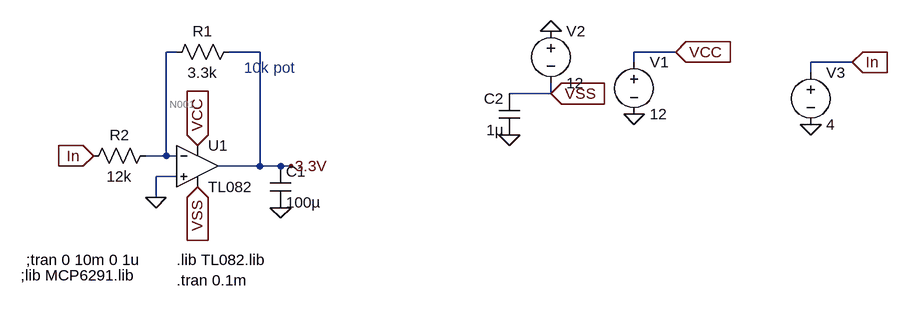
[diagram p0: schematic Draft2.asc]
Draft2.asc, the LTspice schematic file:
Version 4
SHEET 1 968 680
WIRE -176 64 -192 64
WIRE -48 64 -96 64
WIRE 592 64 528 64
WIRE 528 80 528 64
WIRE 864 80 800 80
WIRE 800 96 800 80
WIRE 400 128 400 112
WIRE 400 128 336 128
WIRE -192 224 -192 64
WIRE -192 224 -224 224
WIRE -176 224 -192 224
WIRE -48 240 -48 64
WIRE -48 240 -112 240
WIRE -16 240 -48 240
WIRE 0 240 -16 240
WIRE -176 256 -208 256
WIRE -208 288 -208 256
FLAG 0 240 3.3V
FLAG -208 288 0
FLAG -144 208 VCC
IOPIN -144 208 In
FLAG -304 224 In
IOPIN -304 224 In
FLAG -16 304 0
FLAG 528 160 0
FLAG 400 32 0
FLAG 400 128 VSS
IOPIN 400 128 In
FLAG 592 64 VCC
IOPIN 592 64 In
FLAG 336 192 0
FLAG -144 272 VSS
IOPIN -144 272 In
FLAG 800 176 0
FLAG 864 80 In
IOPIN 864 80 In
SYMBOL res -80 48 R90
WINDOW 0 0 56 VBottom 2
WINDOW 3 32 56 VTop 2
SYMATTR InstName R1
SYMATTR Value 3.3k
SYMBOL res -208 208 R90
WINDOW 0 0 56 VBottom 2
WINDOW 3 32 56 VTop 2
SYMATTR InstName R2
SYMATTR Value 12k
SYMBOL cap -32 240 R0
SYMATTR InstName C1
SYMATTR Value 100µ
SYMBOL voltage 528 64 R0
WINDOW 123 0 0 Left 0
WINDOW 39 0 0 Left 0
SYMATTR InstName V1
SYMATTR Value 12
SYMBOL voltage 400 16 R0
WINDOW 123 0 0 Left 0
WINDOW 39 0 0 Left 0
SYMATTR InstName V2
SYMATTR Value 12
SYMBOL cap 352 192 R180
WINDOW 0 24 56 Left 2
WINDOW 3 24 8 Left 2
SYMATTR InstName C2
SYMATTR Value 1µ
SYMBOL OpAmps\\opamp2 -144 176 R0
SYMATTR InstName U1
SYMATTR Value TL082
SYMBOL voltage 800 80 R0
WINDOW 123 0 0 Left 0
WINDOW 39 0 0 Left 0
SYMATTR InstName V3
SYMATTR Value 4
TEXT -72 88 Left 2 ;10k pot
TEXT -408 384 Left 2 !;tran 0 10m 0 1u
TEXT -416 408 Left 2 !;lib MCP6291.lib
TEXT -176 384 Left 2 !.lib TL082.lib
TEXT -176 416 Left 2 !.tran 0.1m

The netlist it stands for:
* Draft2.asc
R1 3.3V N001 3.3k
R2 N001 In 12k
C1 3.3V 0 100µ
V1 VCC 0 12
V2 0 VSS 12
C2 0 VSS 1µ
XU1 0 N001 VCC VSS 3.3V TL082  ; pins In+ In- V+ V- OUT
V3 In 0 4
* 10k pot
;tran 0 10m 0 1u
;lib MCP6291.lib
.lib TL082.lib
.tran 0.1m
.backanno
.end

* Results of the author's LTspice run, read from the files saved beside the schematic
* Operating Point, zero values left out:
*   V(3.3v) = -1.1 V
*   V(n001) = 16.2 µV
*   V(in) = 4 V
*   V(vcc) = 12 V
*   V(vss) = -12 V
*   I(R2) = -333.3 µA
*   I(R1) = -333.3 µA
*   I(V3) = -333.3 µA
*   I(V2) = -11.39 mA
*   I(V1) = -11.39 mA
*   Ix(u1:1) = 42.05 pA
*   Ix(u1:2) = 42.05 pA
*   Ix(u1:3) = 11.39 mA
*   Ix(u1:4) = -11.39 mA
*   Ix(u1:5) = 333.3 µA